# Altium project GRAVITAS_ZONE_SENSOR.PrjPcb
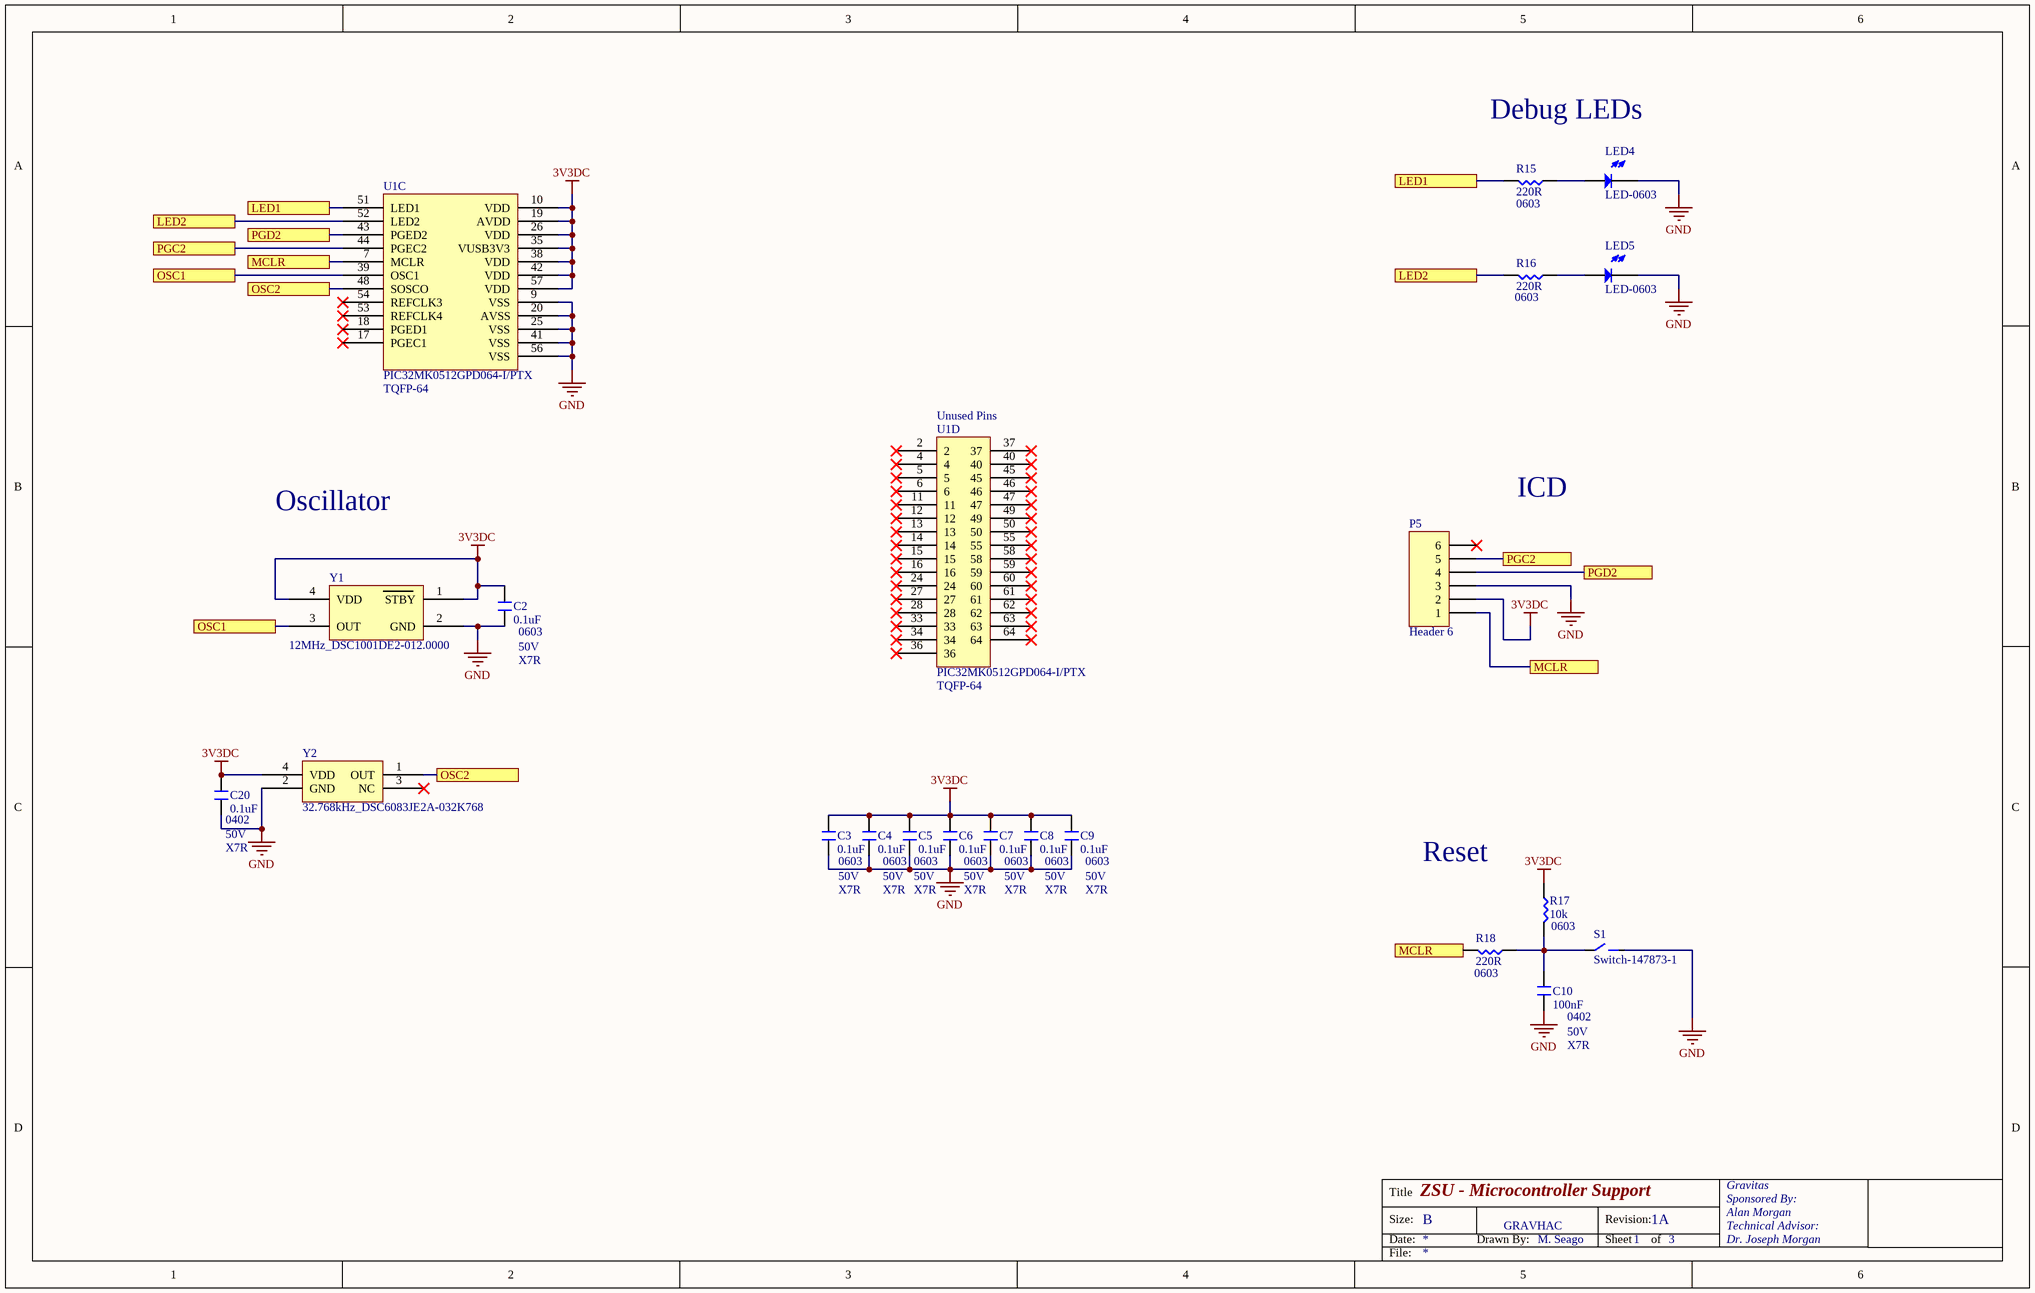
[diagram p0: MCU_SUPPORT_ZS.SchDoc]
3 sheets, 84 parts. Net scope: flat (ports and power ports of the same name join across sheets).
Board file: GRAVITAS_ZONE_SENSOR.PcbDoc
Sheets:
  MCU_SUPPORT_ZS.SchDoc
  LEDS_SENSOR_ZS.SchDoc
  VREG_RS485_ZS.SchDoc

## Sheet MCU_SUPPORT_ZS.SchDoc: ZSU - Microcontroller Support
size B; DrawnBy: M. Seago; Organization: Gravitas; Address1: Sponsored By:; Address2: Alan Morgan; Address3: Technical Advisor:; Address4: Dr. Joseph Morgan; Revision: 1A; SheetNumber: 1; SheetTotal: 3

### Parts
(Parts that share a designator on the sheet are numbered #1, #2 ... from top to bottom, then left to right.)
C2  0.1uF  [NonPolar-0603]
C3  0.1uF  [NonPolar-0603]
C4  0.1uF  [NonPolar-0603]
C5  0.1uF  [NonPolar-0603]
C6  0.1uF  [NonPolar-0603]
C7  0.1uF  [NonPolar-0603]
C8  0.1uF  [NonPolar-0603]
C9  0.1uF  [NonPolar-0603]
C10  100nF  [NonPolar-0402]
C20  0.1uF  [NonPolar-0402]
LED4  LED-0603  [LED-0603]
LED5  LED-0603  [LED-0603]
P5  Header 6  [HDR1X6]
R15  220R  [NonPolar-0603]
R16  220R  [NonPolar-0603]
R17  10k  [NonPolar-0603]
R18  220R  [NonPolar-0603]
S1  Switch-147873-1  [Switch - 147873-1]
U1#1  PIC32MK0512GPD064-I/PTX  [PIC32MK0512GPD064]  (part C of 3)
U1#2  PIC32MK0512GPD064-I/PTX  [V2_PIC32MK0512GPD064IPT]  (part D of 4)
Y1  12MHz_DSC1001DE2-012.0000  [12MHz_DSC1001DE2-012.0000]
Y2  32.768kHz_DSC6083JE2A-032K768  [32.768kHz_DSC6083JE2A-032K768]

### Ports
LED1, LED2, MCLR, OSC1, OSC2, PGC2, PGD2

### Nets
3V3DC: C2.2 C3.2 C4.2 C5.2 C6.2 C7.2 C8.2 C9.2 C20.2 P5.2 R17.2 U1#1.10(VDD) U1#1.19(AVDD) U1#1.26(VDD) U1#1.35(VUSB3V3) U1#1.38(VDD) U1#1.42(VDD) U1#1.57(VDD) Y1.1(STBY) Y1.4(VDD) Y2.4(VDD)
GND: C2.1 C3.1 C4.1 C5.1 C6.1 C7.1 C8.1 C9.1 C10.1 C20.1 LED4.2 LED5.2 P5.3 S1.2 U1#1.9(VSS) U1#1.20(AVSS) U1#1.25(VSS) U1#1.41(VSS) U1#1.56(VSS) Y1.2(GND) Y2.2(GND)
NetC10_2: C10.2 R17.1 R18.2 S1.1
NetLED4_1: LED4.1 R15.2
NetLED5_1: LED5.1 R16.2
NetP5_1: P5.1 R18.1 U1#1.7(MCLR) ; port MCLR
NetP5_4: P5.4 U1#1.43(PGED2) ; port PGD2
NetP5_5: P5.5 U1#1.44(PGEC2) ; port PGC2
NetR15_1: R15.1 U1#1.51(LED1) ; port LED1
NetR16_1: R16.1 U1#1.52(LED2) ; port LED2
NetU1#1_39: U1#1.39(OSC1) Y1.3(OUT) ; port OSC1
NetU1#1_48: U1#1.48(SOSCO) Y2.1(OUT) ; port OSC2

Not connected (* = marked no-connect by the designer): P5 6*; U1#1 17(PGEC1)* 18(PGED1)* 53(REFCLK4)* 54(REFCLK3)*; U1#2 2* 4* 5* 6* 11* 12* 13* 14* 15* 16* 24* 27* 28* 33* 34* 36* 37* 40* 45* 46* 47* 49* 50* 55* 58* 59* 60* 61* 62* 63* 64*; Y2 3(NC)*

### Notes on the sheet
- Debug LEDs
- (near R15) 0603
- (near R16) 0603
- (near U1#1) TQFP-64
- (near U1#2) Unused Pins
- ICD
- Oscillator
- (near C2) 0603
- (near C2) 50V
- (near C2) X7R
- (near U1#2) TQFP-64
- (near C20) 0402
- (near C20) 50V
- (near C20) X7R
- 0603
- 50V
- X7R
- (near C9) 0603
- (near C9) 50V
- Reset
- (near R18) 0603
- (near R17) 0603
- (near C10) 0402
- (near C10) 50V
- (near C10) X7R
- GRAVHAC
- Title
- Size:
- Date:
- B
- Drawn By:
- Revision:
- Sheet
- of
- File:

### Library data of the parts
C2-C9 = Cap - 0603
C10 C20 = Cap - 0402
P5 = Header 6: Header, 6-Pin; LatestRevisionDate: 17-Jul-2002; LatestRevisionNote: Re-released for DXP Platform.; Publisher: Altium Limited
R15-R18 = Res - 0603

## Sheet LEDS_SENSOR_ZS.SchDoc: ZSU - LEDs/Sensor
size B; DrawnBy: M. Seago; Organization: Gravitas; Address1: Sponsored By:; Address2: Alan Morgan; Address3: Technical Advisor:; Address4: Dr. Joseph Morgan; Revision: 1A; SheetNumber: 2; SheetTotal: 3
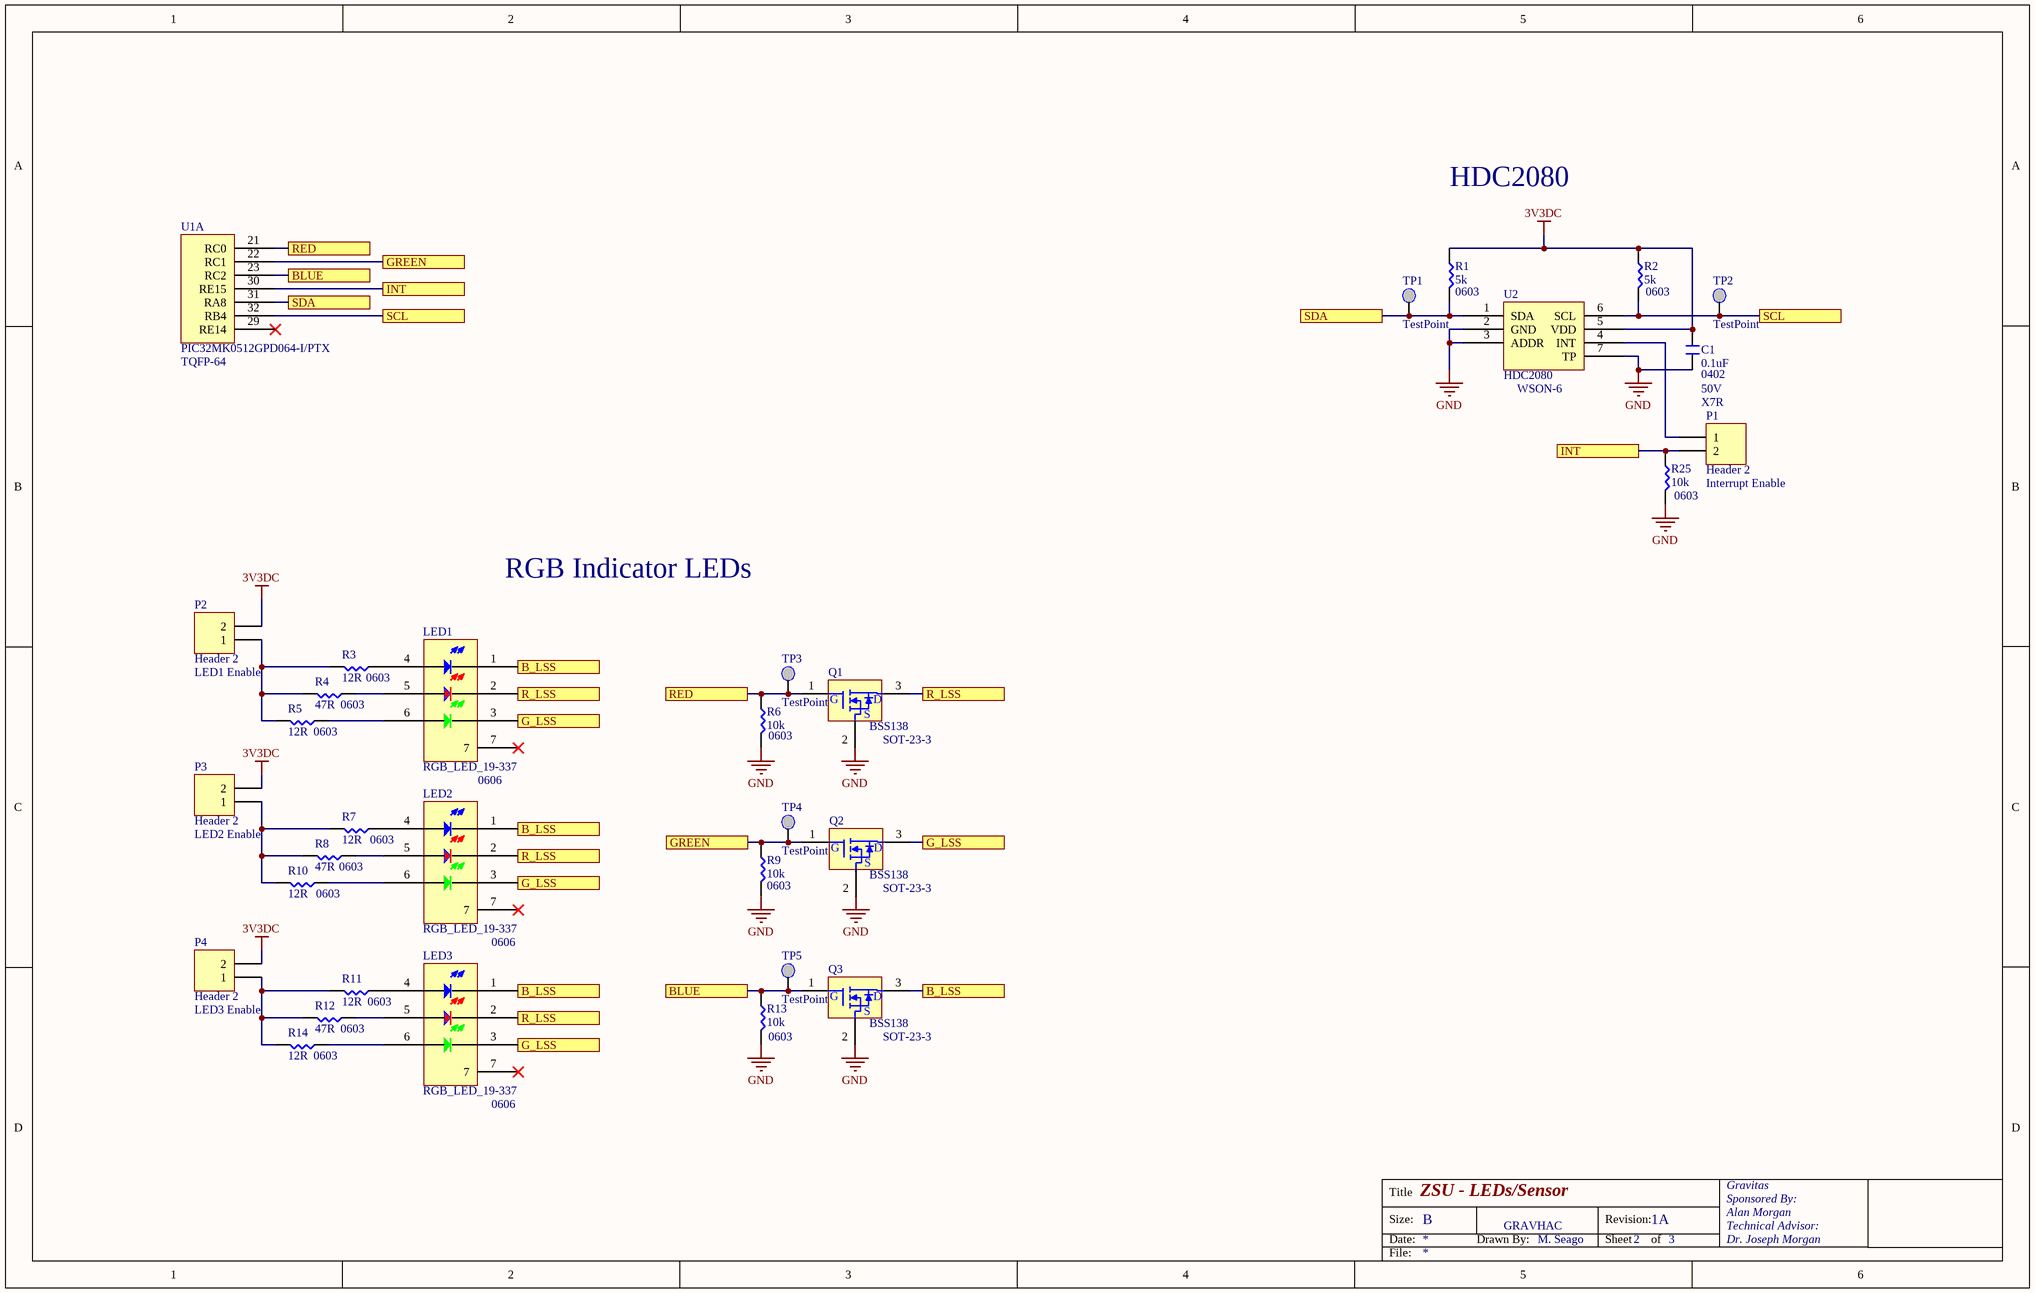
[diagram p1: LEDS_SENSOR_ZS.SchDoc]

### Parts
(Parts that share a designator on the sheet are numbered #1, #2 ... from top to bottom, then left to right.)
C1  0.1uF  [NonPolar-0402]
LED1  RGB_LED_19-337  [RGB_LED_19-337]
LED2  RGB_LED_19-337  [RGB_LED_19-337]
LED3  RGB_LED_19-337  [RGB_LED_19-337]
P1  Header 2  [HDR1X2]
P2  Header 2  [HDR1X2]
P3  Header 2  [HDR1X2]
P4  Header 2  [HDR1X2]
Q1  BSS138  [BSS138-SOT23]
Q2  BSS138  [BSS138-SOT23]
Q3  BSS138  [BSS138-SOT23]
R1  5k  [NonPolar-0603]
R2  5k  [NonPolar-0603]
R3  12R  [NonPolar-0603]
R4  47R  [NonPolar-0603]
R5  12R  [NonPolar-0603]
R6  10k  [NonPolar-0603]
R7  12R  [NonPolar-0603]
R8  47R  [NonPolar-0603]
R9  10k  [NonPolar-0603]
R10  12R  [NonPolar-0603]
R11  12R  [NonPolar-0603]
R12  47R  [NonPolar-0603]
R13  10k  [NonPolar-0603]
R14  12R  [NonPolar-0603]
R25  10k  [NonPolar-0603]
TP1  TestPoint  [TP - S2751-46R]
TP2  TestPoint  [TP - S2751-46R]
TP3  TestPoint  [TP - S2751-46R]
TP4  TestPoint  [TP - S2751-46R]
TP5  TestPoint  [TP - S2751-46R]
U1#1  PIC32MK0512GPD064-I/PTX  [PIC32MK0512GPD064]  (part A of 3)
U2  HDC2080  [HDC2080]

### Ports
B_LSS, BLUE, G_LSS, GREEN, INT, R_LSS, RED, SCL, SDA

### Nets
3V3DC: C1.2 P2.2 P3.2 P4.2 R1.2 R2.2 U2.5(VDD)
GND: C1.1 Q1.2(S) Q2.2(S) Q3.2(S) R6.1 R9.1 R13.1 R25.1 U2.2(GND) U2.3(ADDR) U2.7(TP)
NetLED1_1: LED1.1 LED2.1 LED3.1 Q3.3(D) ; port B_LSS
NetLED1_2: LED1.2 LED2.2 LED3.2 Q1.3(D) ; port R_LSS
NetLED1_3: LED1.3 LED2.3 LED3.3 Q2.3(D) ; port G_LSS
NetLED1_4: LED1.4 R3.2
NetLED1_5: LED1.5 R4.2
NetLED1_6: LED1.6 R5.2
NetLED2_4: LED2.4 R7.2
NetLED2_5: LED2.5 R8.2
NetLED2_6: LED2.6 R10.2
NetLED3_4: LED3.4 R11.2
NetLED3_5: LED3.5 R12.2
NetLED3_6: LED3.6 R14.2
NetP1_1: P1.1 U2.4(INT)
NetP1_2: P1.2 R25.2 U1#1.30(RE15) ; port INT
NetP2_1: P2.1 R3.1 R4.1 R5.1
NetP3_1: P3.1 R7.1 R8.1 R10.1
NetP4_1: P4.1 R11.1 R12.1 R14.1
NetQ1_1: Q1.1(G) R6.2 TP3.1 U1#1.21(RC0) ; port RED
NetQ2_1: Q2.1(G) R9.2 TP4.1 U1#1.22(RC1) ; port GREEN
NetQ3_1: Q3.1(G) R13.2 TP5.1 U1#1.23(RC2) ; port BLUE
NetR1_1: R1.1 TP1.1 U1#1.31(RA8) U2.1(SDA) ; port SDA
NetR2_1: R2.1 TP2.1 U1#1.32(RB4) U2.6(SCL) ; port SCL

Not connected (* = marked no-connect by the designer): LED1 7*; LED2 7*; LED3 7*; U1#1 29(RE14)*

### Notes on the sheet
- HDC2080
- (near R1) 0603
- (near R2) 0603
- (near U1#1) TQFP-64
- (near U2) WSON-6
- (near C1) 0402
- 50V
- X7R
- (near R25) 0603
- Interrupt Enable
- RGB Indicator LEDs
- (near P2) LED1 Enable
- (near R4) 0603
- (near R3) 0603
- (near R5) 0603
- (near R6) 0603
- (near Q1) SOT-23-3
- (near P3) LED2 Enable
- (near R7) 0603
- 0606
- (near R10) 0603
- (near R8) 0603
- (near R9) 0603
- (near Q2) SOT-23-3
- LED3 Enable
- (near R12) 0603
- (near R11) 0603
- (near R13) 0603
- (near Q3) SOT-23-3
- (near R14) 0603
- (near LED3) 0606
- GRAVHAC
- Title
- Size:
- Date:
- B
- Drawn By:
- Revision:
- Sheet
- of
- File:

### Library data of the parts
C1 = Cap - 0402
P1-P4 = Header 2: Header, 2-Pin; LatestRevisionDate: 17-Jul-2002; LatestRevisionNote: Re-released for DXP Platform.; Publisher: Altium Limited
R1-R14 R25 = Res - 0603
TP1-TP5 = TestPoint: S2751-46R

## Sheet VREG_RS485_ZS.SchDoc: ZSU - VREG/RS485
size B; DrawnBy: M. Seago; Organization: Gravitas; Address1: Sponsored By:; Address2: Alan Morgan; Address3: Technical Advisor:; Address4: Dr. Joseph Morgan; Revision: 1A; SheetNumber: 3; SheetTotal: 3
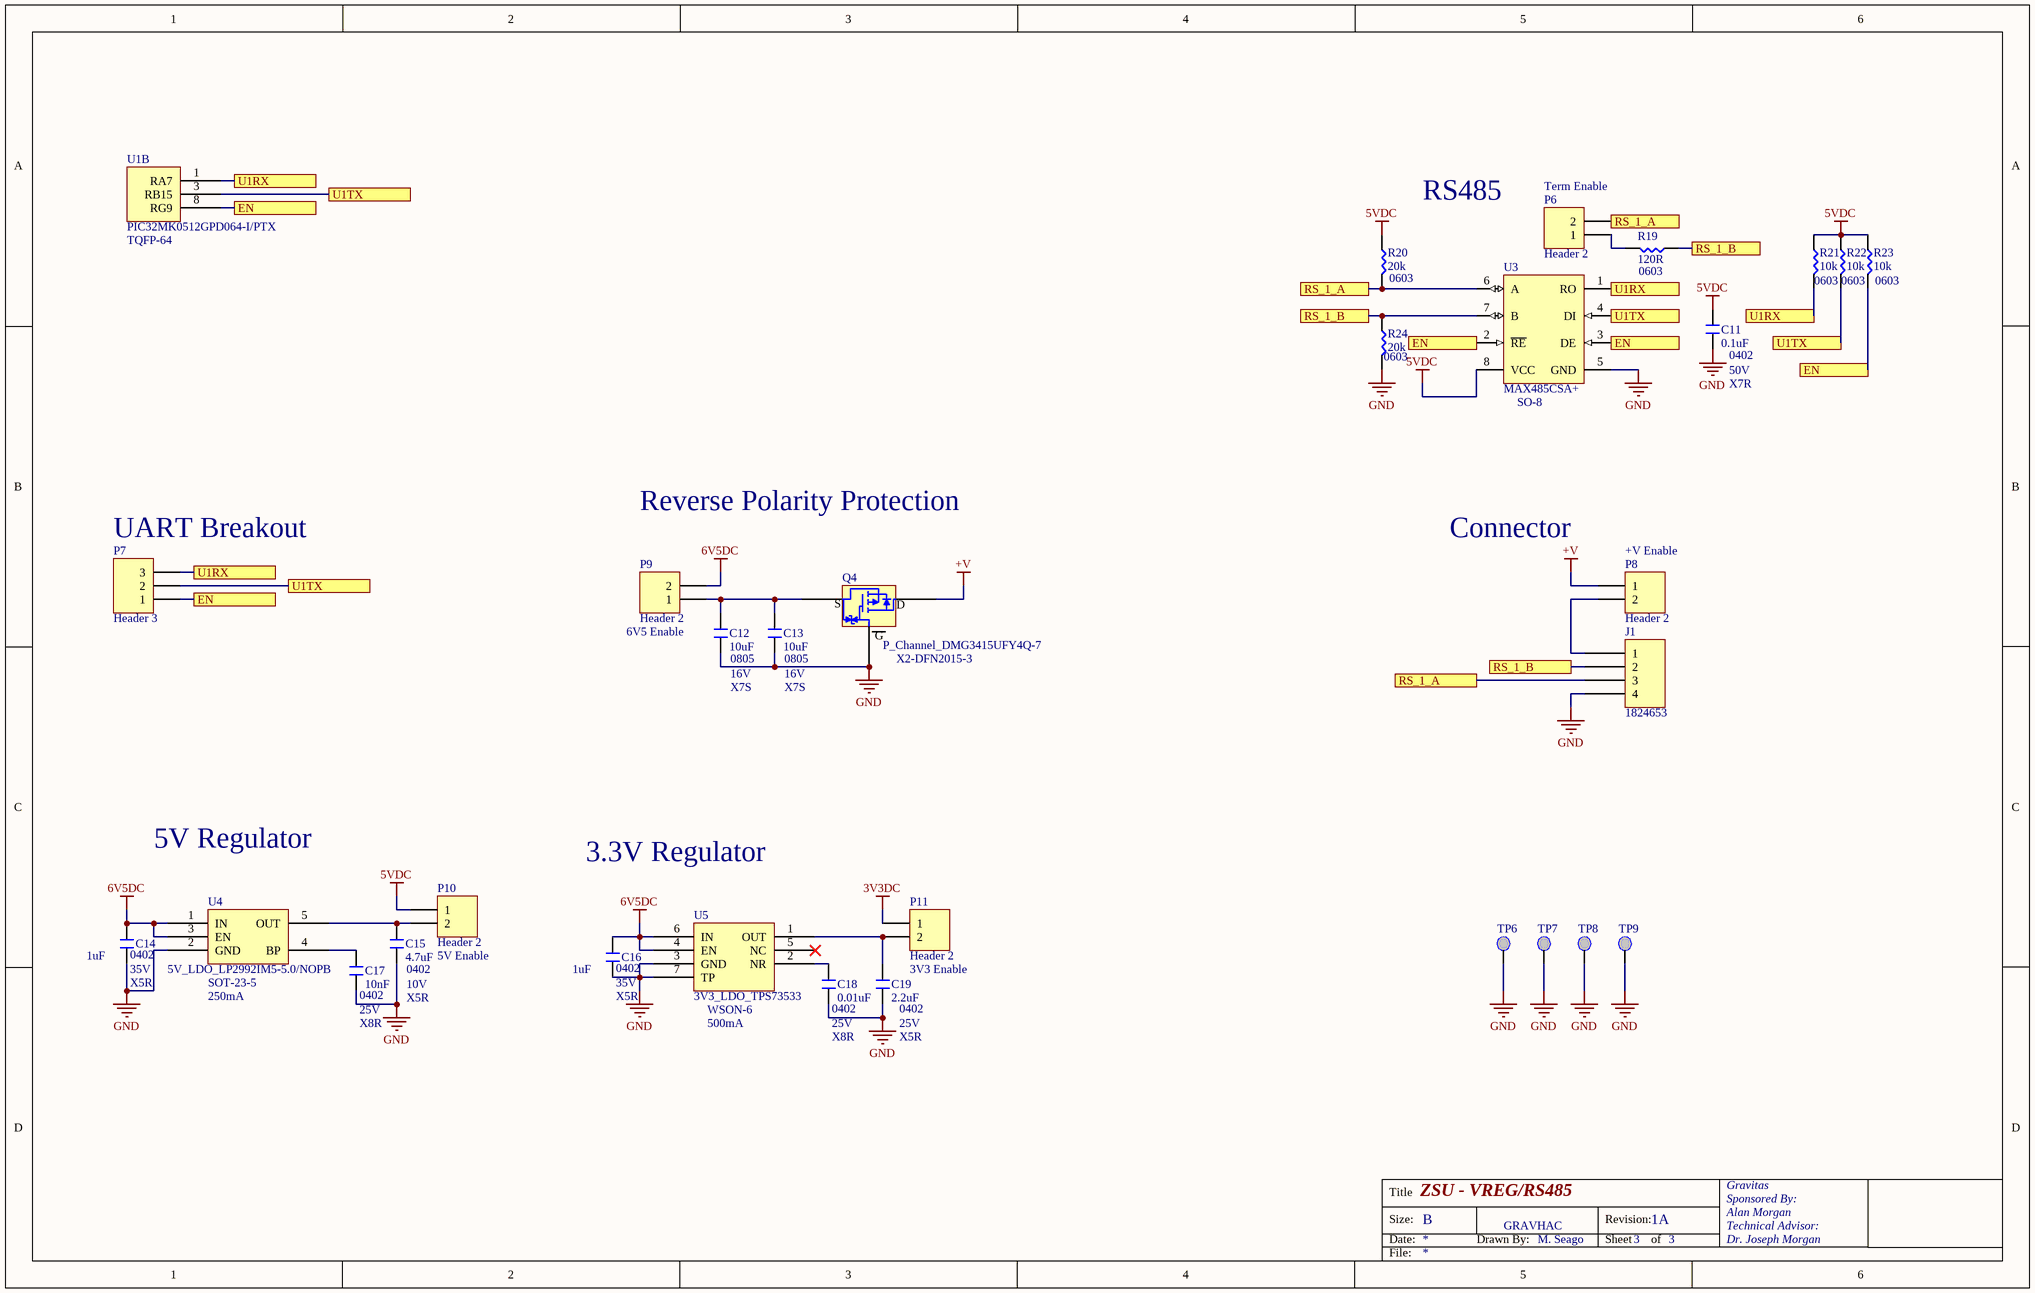
[diagram p2: VREG_RS485_ZS.SchDoc]

### Parts
(Parts that share a designator on the sheet are numbered #1, #2 ... from top to bottom, then left to right.)
C11  0.1uF  [NonPolar-0402]
C12  10uF  [NonPolar-0805]
C13  10uF  [NonPolar-0805]
C14  1uF  [NonPolar-0402]
C15  4.7uF  [NonPolar-0402]
C16  1uF  [NonPolar-0402]
C17  10nF  [NonPolar-0402]
C18  0.01uF  [NonPolar-0402]
C19  2.2uF  [NonPolar-0402]
J1  1824653  [1824653]
P6  Header 2  [HDR1X2]
P7  Header 3  [HDR1X3]
P8  Header 2  [HDR1X2]
P9  Header 2  [HDR1X2]
P10  Header 2  [HDR1X2]
P11  Header 2  [HDR1X2]
Q4  P_Channel_DMG3415UFY4Q-7  [P_Channel_DMG3415UFY4Q-7_attempt1]
R19  120R  [NonPolar-0603]
R20  20k  [NonPolar-0603]
R21  10k  [NonPolar-0603]
R22  10k  [NonPolar-0603]
R23  10k  [NonPolar-0603]
R24  20k  [NonPolar-0603]
TP6  TestPoint  [TP - S2751-46R]  (value not drawn)
TP7  TestPoint  [TP - S2751-46R]  (value not drawn)
TP8  TestPoint  [TP - S2751-46R]  (value not drawn)
TP9  TestPoint  [TP - S2751-46R]  (value not drawn)
U1#1  PIC32MK0512GPD064-I/PTX  [PIC32MK0512GPD064]  (part B of 3)
U3  MAX485CSA+  [MAXM-MAX485CSA+-8_M]
U4  5V_LDO_LP2992IM5-5.0/NOPB  [LP2992IM5-5.0/NOPB]
U5  3V3_LDO_TPS73533  [TPS73533DRVT]

### Ports
EN, RS_1_A, RS_1_B, U1RX, U1TX

### Nets
3V3DC: P11.1
5VDC: C11.2 P10.1 R20.2 R21.2 R22.2 R23.2 U3.8(VCC)
6V5DC: C14.2 C16.2 P9.2 U4.1(IN) U4.3(EN) U5.4(EN) U5.6(IN)
+V: P8.1 Q4.3
GND: C11.1 C12.1 C13.1 C14.1 C15.1 C16.1 C17.1 C18.1 C19.1 J1.4 Q4.1 R24.1 TP6.1 TP7.1 TP8.1 TP9.1 U3.5(GND) U4.2(GND) U5.3(GND) U5.7(TP)
NetC12_2: C12.2 C13.2 P9.1 Q4.2
NetC15_2: C15.2 P10.2 U4.5(OUT)
NetC17_2: C17.2 U4.4(BP)
NetC18_2: C18.2 U5.2(NR)
NetC19_2: C19.2 P11.2 U5.1(OUT)
NetJ1_1: J1.1 P8.2
NetJ1_2: J1.2 R19.2 R24.2 U3.7(B) ; port RS_1_B
NetJ1_3: J1.3 P6.2 R20.1 U3.6(A) ; port RS_1_A
NetP6_1: P6.1 R19.1
NetP7_1: P7.1 R23.1 U1#1.8(RG9) U3.2(~{RE}) U3.3(DE) ; port EN
NetP7_2: P7.2 R22.1 U1#1.3(RB15) U3.4(DI) ; port U1TX
NetP7_3: P7.3 R21.1 U1#1.1(RA7) U3.1(RO) ; port U1RX

Not connected (* = marked no-connect by the designer): U5 5(NC)*

### Notes on the sheet
- RS485
- (near P6) Term Enable
- (near U1#1) TQFP-64
- (near R20) 0603
- (near R19) 0603
- 0603
- (near R23) 0603
- (near R24) 0603
- (near C11) 0402
- (near U3) SO-8
- (near C11) 50V
- (near C11) X7R
- (near P7) UART Breakout
- Reverse Polarity Protection
- Connector
- (near P8) +V Enable
- 6V5 Enable
- 0805
- 16V
- X7S
- (near C13) 0805
- (near C13) 16V
- (near Q4) X2-DFN2015-3
- 5V Regulator
- 3.3V Regulator
- (near C14) 0402
- (near C14) 35V
- (near C15) 0402
- 5V Enable
- (near C16) 0402
- 3V3 Enable
- (near C14) X5R
- (near U4) SOT-23-5
- (near U4) 250mA
- (near C17) 0402
- (near C17) 25V
- (near C17) X8R
- 10V
- X5R
- (near C16) 35V
- (near C16) X5R
- (near U5) WSON-6
- (near U5) 500mA
- (near C18) 0402
- 25V
- X8R
- (near C19) 0402
- (near C19) 25V
- (near C19) X5R
- GRAVHAC
- Title
- Size:
- Date:
- B
- Drawn By:
- Revision:
- Sheet
- of
- File:
- (in symbol P_Channel_DMG3415UFY4Q-7) S; D; G

### Library data of the parts
C11 C14-C19 = Cap - 0402
C12 C13 = Cap - 0805
P6 P8-P11 = Header 2: Header, 2-Pin; LatestRevisionDate: 17-Jul-2002; LatestRevisionNote: Re-released for DXP Platform.; Publisher: Altium Limited
P7 = Header 3: Header, 3-Pin; LatestRevisionDate: 17-Jul-2002; LatestRevisionNote: Re-released for DXP Platform.; Publisher: Altium Limited
R19-R24 = Res - 0603
TP6-TP9 = TestPoint: S2751-46R
U3 = CMP-2000-05211-1: Low-Power, Slew-Rate-Limited RS-485/RS-422 Transceiver, 4.75 to 5.25 V, 0 to 70 degC, 8-Pin SOIC, RoHS, Tape and Reel; Manufacturer: Maxim; No. of Receivers: 1; Transceiver Type: Differential; Supply Voltage Min: 4.75V; IC Generic Number: 485; IC Temperature Range: Commercial; No. of Pins: 8; Supply Voltage Range: 4.75Vto5.25V; Interface: RS-422/RS-485; Supply Voltage Max: 5.25V; Data Rate: 2.5Mbps; Line / Bus Driver / Receiver / Transceiver Type: CMOSDifferential; Supply Current: 500µA; Interface Type: RS422,RS485; Device Type: Transceiver; Manufacturer URL: http://www.maximintegrated.com/; Operating Temperature Range: 0degCto+70degC; Package / Case: SOIC; Digital IC Case Style: SOIC; Operating Temperature Max: 70degC; Device Marking: MAX485CSA+; Driver Case Style: SOIC; Datasheet Version: Rev. 8, 10/2003; Operating Temperature Min: 0degC; Datasheet URL: https://datasheet.ciiva.com/29306/170071-da-01-en-ic-max485csa-so8-29306144.pdf; Base Number: 485; No. of Drivers: 1; Logic Function Number: 485

## Nets that join several sheets
3V3DC: MCU_SUPPORT_ZS (21 pins), LEDS_SENSOR_ZS (7 pins), VREG_RS485_ZS (P11.1)
GND: MCU_SUPPORT_ZS (21 pins), LEDS_SENSOR_ZS (11 pins), VREG_RS485_ZS (20 pins)